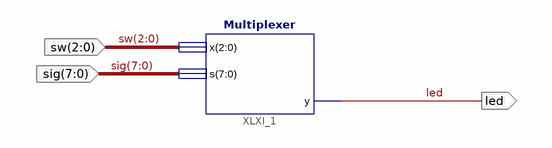
[diagram p0: schematic sheet 1]
// Xilinx ISE schematic scheme.sch (spartan6) as structural Verilog: 1 symbols, 3 ports
module scheme (
  input  [2:0] sw,
  input  [7:0] sig,
  output led
);

  Multiplexer XLXI_1 (.x(sw), .s(sig), .y(led));
endmodule
